# EAGLE design usb-pickit2-adapter (EAGLE 7.5.0)
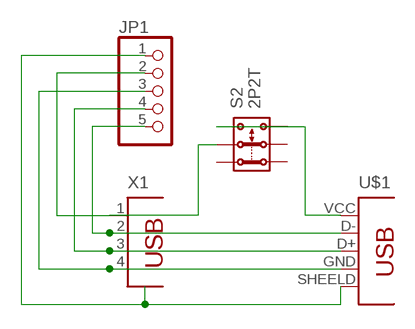
[diagram p0: schematic, sheet 1]

## Parts
JP1  PINHD-1X5  [1X05]
S2  2P2T  [2P2T]
U$1  TYPE-A+SHILED  [TYPE-A]
X1  PN87520  [PN87520]

## Nets
N$1: JP1.2 S2.2.1 X1.1
N$2: JP1.3 U$1.GND X1.4
N$3: S2.3.1 U$1.VCC
N$4: JP1.5 U$1.D- X1.2
N$5: JP1.4 U$1.D+ X1.3
N$6: JP1.1 U$1.SHEELD
Unconnected: S2.1.1 S2.1.2 S2.2.2 S2.3.2

## Library data of the parts
JP1 = pinhead:PINHD-1X5: PIN HEADER
S2 = switch:2P2T: SLIDE SWITCH 2P2T Part No. SS-22F05-G(A)4 Source: CANAL ELECTRONIC CO., LTD .. switsch.pdf
U$1 = usb-connector:TYPE-A+SHILED
X1 = con-berg:PN87520: BERG USB connector; OC_FARNELL: unknown; OC_NEWARK: unknown

## Board
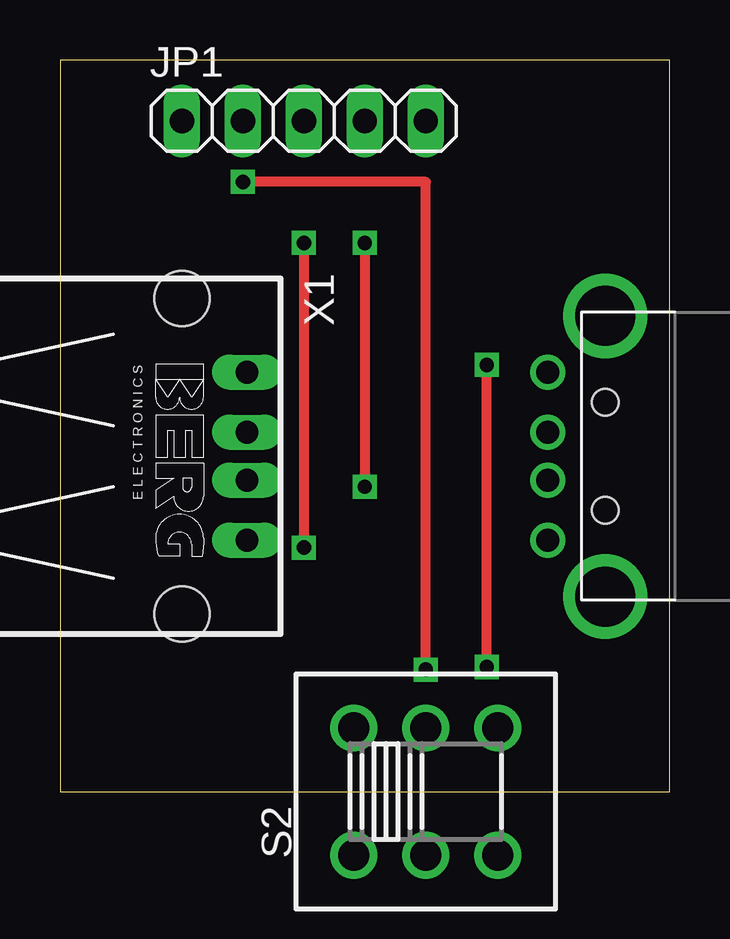
[diagram p1: board, top side]
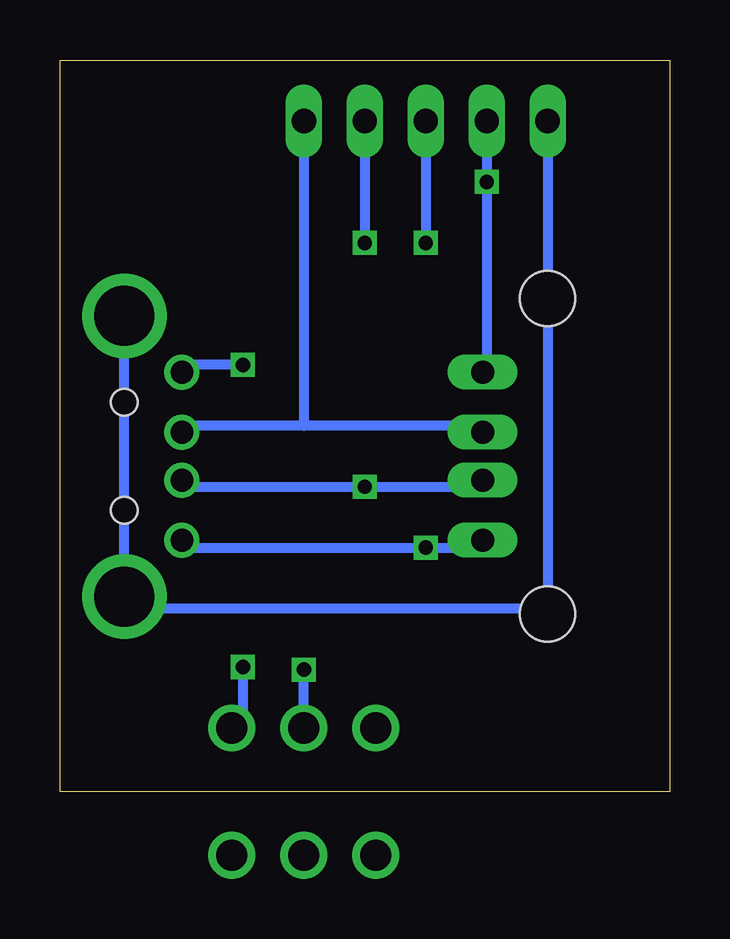
[diagram p2: board, bottom side, seen from below]

Size 25.4 x 30.48 mm. Coordinates in mm from the lower left corner, seen from the top.
Outline: 0,0 25.4,0 25.4,30.48 0,30.48 0,0
Copper layers (1*16): Top 0.035mm / dielectric 1.5mm / Bottom 0.035mm
Design rules "default": minimum track width 10mil, minimum drill 24mil, track to track 8mil, track to pad 8mil, pad to pad 8mil, via to via 8mil, smd to smd 8mil, copper to edge 40mil, drill to drill 8mil, minimum pad ring 10mil, minimum via ring 8mil, stop-mask expansion 4mil, vias tented up to drill 0mil, thermal gap 10mil

### Footprints (pad centres in the part's own frame; a part is rotated, then mirrored left to right if it is on the bottom)
1X05 = drill 1.016 long: 1 -5.08,0; 2 -2.54,0; 3 0,0; 4 2.54,0; 5 5.08,0
2P2T = drill 1.3 pad 1.93: 1.1 -3,2.65; 1.2 -3,-2.65; 2.1 0,2.65; 2.2 0,-2.65; 3.1 3,2.65; 3.2 3,-2.65
TYPE-A = drill 0.95: D+ 1,0; D- -1,0; GND 3.5,0; VCC -3.5,0 | drill 2.5: SHEELD -5.85,2.4; SHEELD2 5.85,2.4 | hole 1.1: -2.25,2.4; 2.25,2.4
PN87520 = drill 0.95 long: 1 -3.5,2.71; 2 -1,2.71; 3 1,2.71; 4 3.5,2.71 | hole 2.3: -6.57,0; 6.57,0

### Placement (x,y rotation side)
JP1  10.16,27.94 0 top
S2  15.24,0 0 top
U$1  20.32,13.97 270 top
X1  5.08,13.97 270 top

### Tracks (layer width: path | path; a pad name or v marks a point on that pad's centre or on a via)
N$1  (via drill 0.6)
  Top 0.406: v15.24,5.08 15.24,25.4 v7.62,25.4
  Bottom 0.406: X1.1 7.62,17.47 v7.62,25.4 JP1.2 | 15.24,2.26 S2.2.1 v15.24,5.08
N$2  (via drill 0.6)
  Top 0.406: v10.16,22.86 v10.16,10.16
  Bottom 0.406: U$1.GND 20.32,10.16 v10.16,10.16 7.79,10.16 | 7.62,10.16 7.79,10.16 | 7.79,10.16 X1.4 | JP1.3 v10.16,22.86
N$3  (via drill 0.6)
  Top 0.406: v17.78,5.19 v17.78,17.78
  Bottom 0.406: v17.78,5.19 17.78,2.65 | v17.78,17.78 20.32,17.78 U$1.VCC | S2.3.1 17.78,2.65 | 17.78,2.65 17.78,2.54
N$4
  Bottom 0.406: JP1.5 15.24,15.24 | 15.24,15.24 20.32,15.24 U$1.D- | X1.2 7.62,14.97 7.62,15.24 15.24,15.24
N$5  (via drill 0.6)
  Top 0.406: v12.7,22.86 v12.7,12.7
  Bottom 0.406: U$1.D+ 20.32,12.7 v12.7,12.7 7.79,12.7 | 7.62,12.7 7.79,12.7 | 7.79,12.7 X1.3 | JP1.4 v12.7,22.86
N$6
  Bottom 0.406: JP1.1 5.08,7.62 22.72,7.62 | 22.86,7.62 22.72,7.62 | 22.72,7.62 U$1.SHEELD